# EAGLE design rc2014_3kb_ram (EAGLE 8.1.1)
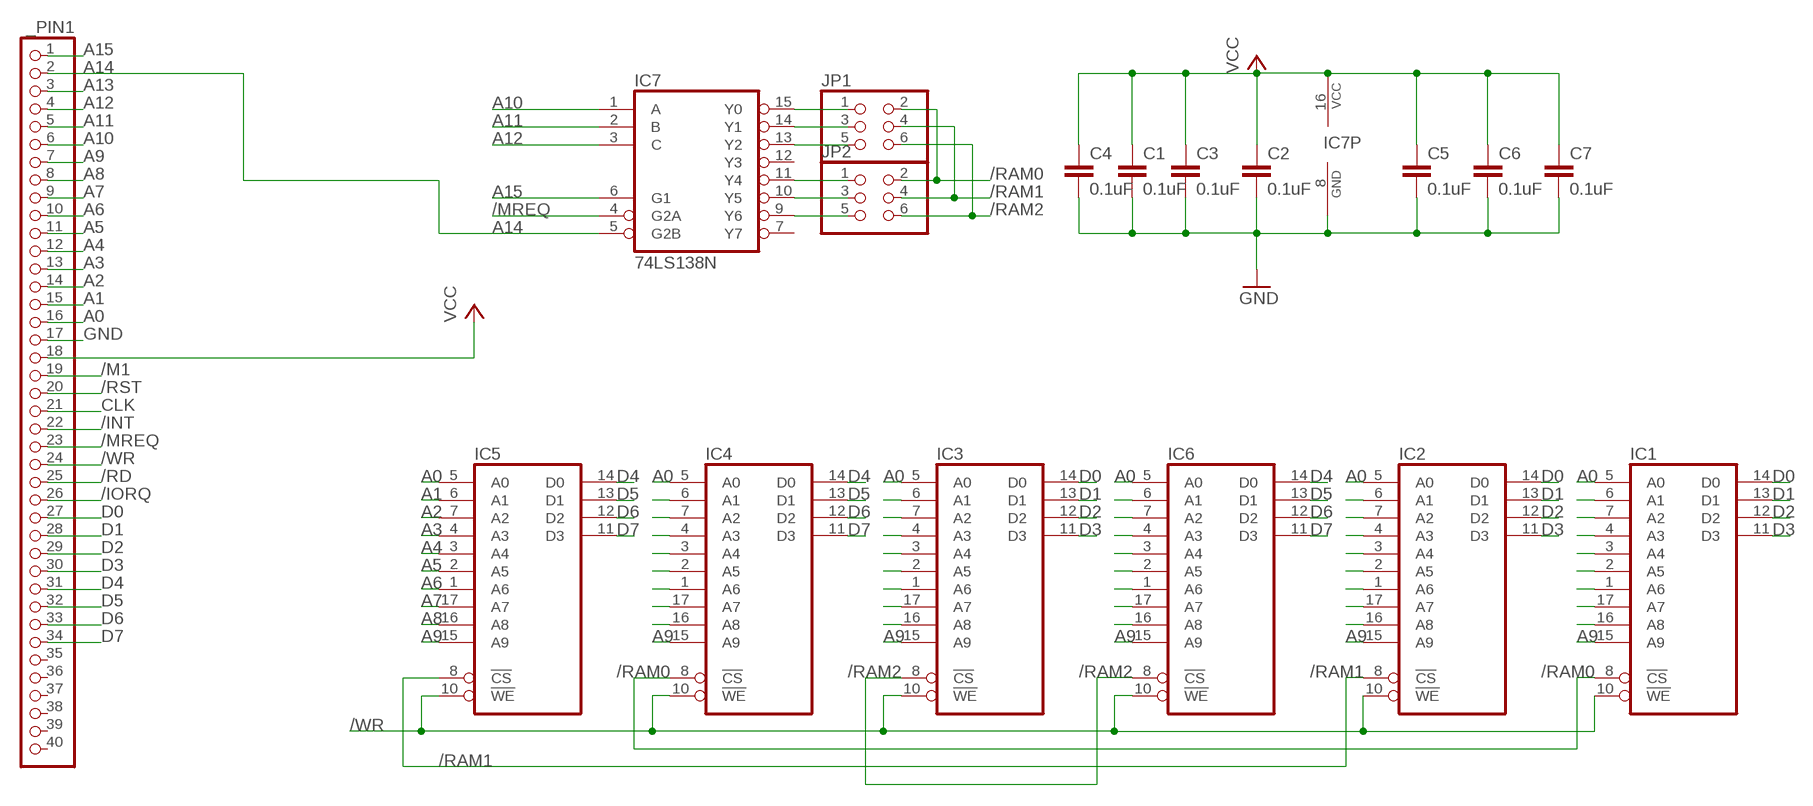
[diagram p0: schematic, sheet 1]

## Parts
_PIN1  PINHD-1X40  [1X40]
C1  0.1uF  C-EU050-024X044  [C050-024X044]
C2  0.1uF  C-EU050-024X044  [C050-024X044]
C3  0.1uF  C-EU050-024X044  [C050-024X044]
C4  0.1uF  C-EU050-024X044  [C050-024X044]
C5  0.1uF  C-EU050-024X044  [C050-024X044]
C6  0.1uF  C-EU050-024X044  [C050-024X044]
C7  0.1uF  C-EU050-024X044  [C050-024X044]
IC1  2114  [DIL18]
IC2  2114  [DIL18]
IC3  2114  [DIL18]
IC4  2114  [DIL18]
IC5  2114  [DIL18]
IC6  2114  [DIL18]
IC7  74LS138N  [DIL16]
JP1  PINHD-2X3  [2X03]
JP2  PINHD-2X3  [2X03]

## Nets
/INT: _PIN1.22
/IORQ: _PIN1.26
/M1: _PIN1.19
/MREQ: _PIN1.23 IC7.4(G2A)
/RAM0: IC1.8(!CS) IC4.8(!CS) JP1.2 JP2.2
/RAM1: IC2.8(!CS) IC5.8(!CS) JP1.4 JP2.4
/RAM2: IC3.8(!CS) IC6.8(!CS) JP1.6 JP2.6
/RD: _PIN1.25
/RST: _PIN1.20
/WR: _PIN1.24 IC1.10(!WE) IC2.10(!WE) IC3.10(!WE) IC4.10(!WE) IC5.10(!WE) IC6.10(!WE)
A0: _PIN1.16 IC1.5(A0) IC2.5(A0) IC3.5(A0) IC4.5(A0) IC5.5(A0) IC6.5(A0)
A1: _PIN1.15 IC1.6(A1) IC2.6(A1) IC3.6(A1) IC4.6(A1) IC5.6(A1) IC6.6(A1)
A2: _PIN1.14 IC1.7(A2) IC2.7(A2) IC3.7(A2) IC4.7(A2) IC5.7(A2) IC6.7(A2)
A3: _PIN1.13 IC1.4(A3) IC2.4(A3) IC3.4(A3) IC4.4(A3) IC5.4(A3) IC6.4(A3)
A4: _PIN1.12 IC1.3(A4) IC2.3(A4) IC3.3(A4) IC4.3(A4) IC5.3(A4) IC6.3(A4)
A5: _PIN1.11 IC1.2(A5) IC2.2(A5) IC3.2(A5) IC4.2(A5) IC5.2(A5) IC6.2(A5)
A6: _PIN1.10 IC1.1(A6) IC2.1(A6) IC3.1(A6) IC4.1(A6) IC5.1(A6) IC6.1(A6)
A7: _PIN1.9 IC1.17(A7) IC2.17(A7) IC3.17(A7) IC4.17(A7) IC5.17(A7) IC6.17(A7)
A8: _PIN1.8 IC1.16(A8) IC2.16(A8) IC3.16(A8) IC4.16(A8) IC5.16(A8) IC6.16(A8)
A9: _PIN1.7 IC1.15(A9) IC2.15(A9) IC3.15(A9) IC4.15(A9) IC5.15(A9) IC6.15(A9)
A10: _PIN1.6 IC7.1(A)
A11: _PIN1.5 IC7.2(B)
A12: _PIN1.4 IC7.3(C)
A13: _PIN1.3
A14: _PIN1.2 IC7.5(G2B)
A15: _PIN1.1 IC7.6(G1)
CLK: _PIN1.21
D0: _PIN1.27 IC1.14(D0) IC2.14(D0) IC3.14(D0)
D1: _PIN1.28 IC1.13(D1) IC2.13(D1) IC3.13(D1)
D2: _PIN1.29 IC1.12(D2) IC2.12(D2) IC3.12(D2)
D3: _PIN1.30 IC1.11(D3) IC2.11(D3) IC3.11(D3)
D4: _PIN1.31 IC4.14(D0) IC5.14(D0) IC6.14(D0)
D5: _PIN1.32 IC4.13(D1) IC5.13(D1) IC6.13(D1)
D6: _PIN1.33 IC4.12(D2) IC5.12(D2) IC6.12(D2)
D7: _PIN1.34 IC4.11(D3) IC5.11(D3) IC6.11(D3)
GND: _PIN1.17 C1.2 C2.2 C3.2 C4.2 C5.2 C6.2 C7.2 IC7.8(GND)
N$7: IC7.15(Y0) JP1.1
N$8: IC7.14(Y1) JP1.3
N$9: IC7.13(Y2) JP1.5
N$11: IC7.11(Y4) JP2.1
N$12: IC7.10(Y5) JP2.3
N$13: IC7.9(Y6) JP2.5
VCC: _PIN1.18 C1.1 C2.1 C3.1 C4.1 C5.1 C6.1 C7.1 IC7.16(VCC)
Unconnected: _PIN1.35 _PIN1.36 _PIN1.37 _PIN1.38 _PIN1.39 _PIN1.40 IC7.7(Y7) IC7.12(Y3)

## Power pins joined to a net without a drawn wire
GND: IC1.9(GND) IC2.9(GND) IC3.9(GND) IC4.9(GND) IC5.9(GND) IC6.9(GND)
VCC: IC1.18(VCC) IC2.18(VCC) IC3.18(VCC) IC4.18(VCC) IC5.18(VCC) IC6.18(VCC)

## Library data of the parts
_PIN1 = pinhead:PINHD-1X40: PIN HEADER
C1-C7 = rcl:C-EU: CAPACITOR, European symbol
IC1-IC6 = memory:2114: MEMORY
IC7 = 74xx-us:74*138: 3-line to 8-line DECODER/DEMULTIPLEXER
JP1 JP2 = pinhead:PINHD-2X3: PIN HEADER

## Net classes
0 +5V: width 0.508 mm

## Board
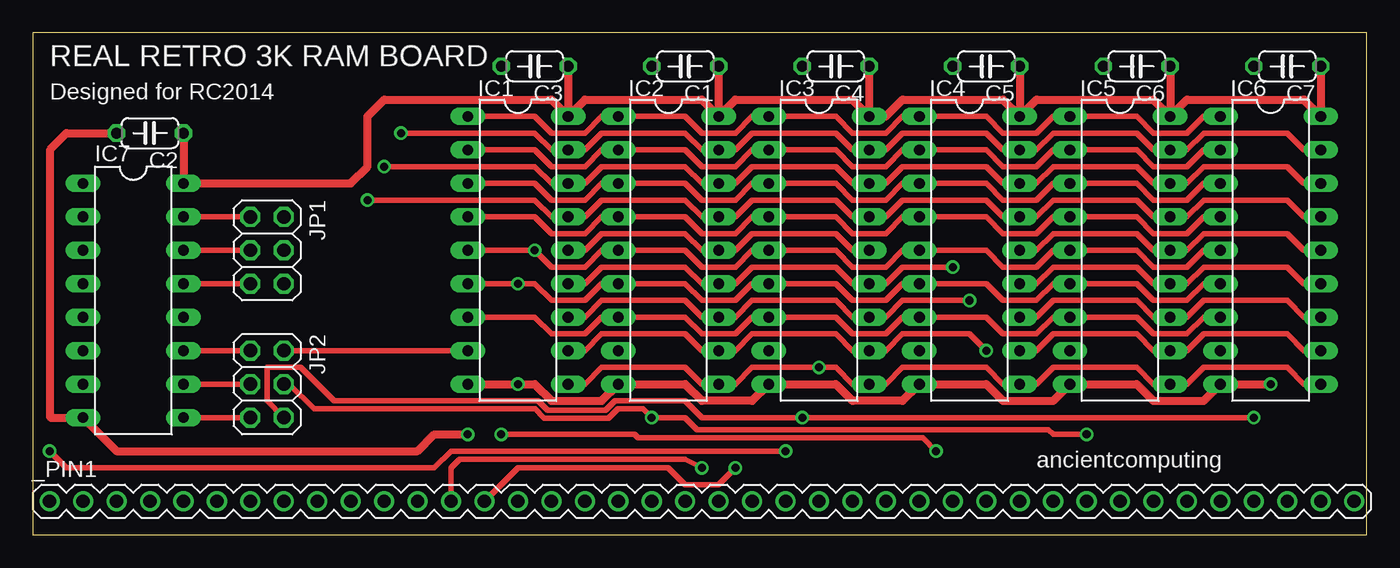
[diagram p1: board, top side]
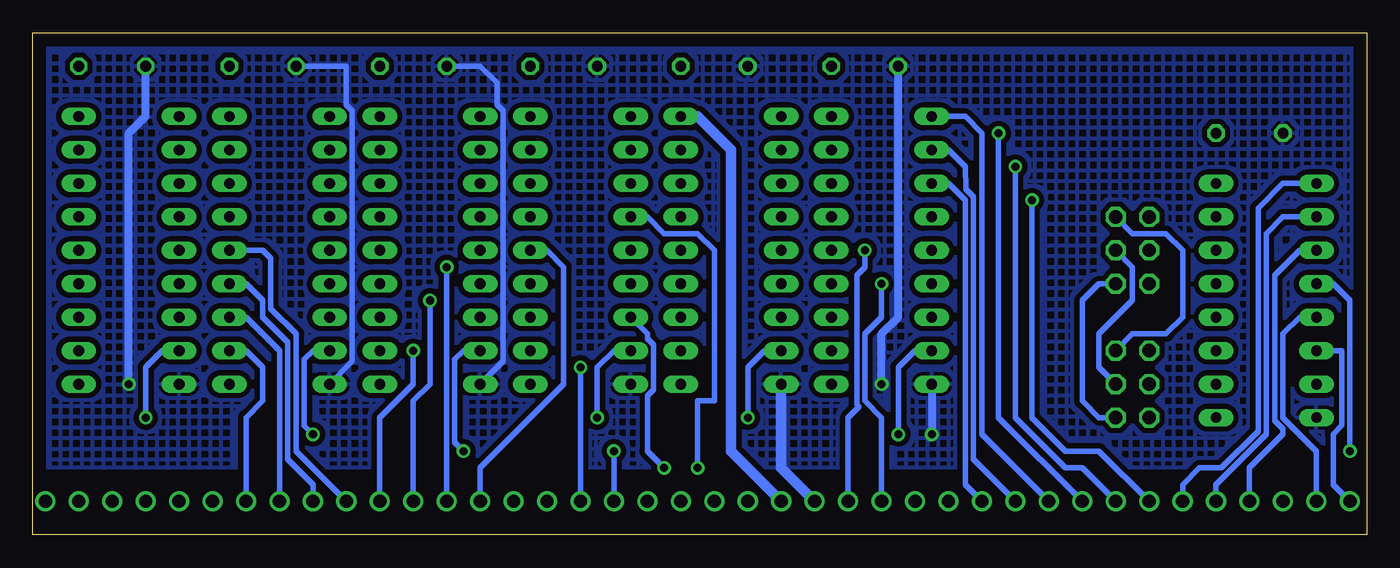
[diagram p2: board, bottom side, seen from below]

Size 101.27 x 38.09 mm. Coordinates in mm from the lower left corner, seen from the top.
Outline: 0,0 101.27,0 101.27,38.09 0,38.09 0,0
Copper layers (1*16): Top 0.035mm / dielectric 1.5mm / Bottom 0.035mm
Design rules "default *": minimum track width 20mil, minimum drill 24mil, track to track 8mil, track to pad 8mil, pad to pad 8mil, via to via 8mil, smd to smd 8mil, copper to edge 40mil, drill to drill 8mil, minimum pad ring 10mil, minimum via ring 8mil, stop-mask expansion 4mil, vias tented up to drill 0mil, thermal gap 10mil

### Footprints (pad centres in the part's own frame; a part is rotated, then mirrored left to right if it is on the bottom)
1X40 = drill 1.016: 1 -49.53,0; 2 -46.99,0; 3 -44.45,0; 4 -41.91,0; 5 -39.37,0; 6 -36.83,0; 7 -34.29,0; 8 -31.75,0; 9 -29.21,0; 10 -26.67,0; 11 -24.13,0; 12 -21.59,0; 13 -19.05,0; 14 -16.51,0; 15 -13.97,0; 16 -11.43,0; 17 -8.89,0; 18 -6.35,0; 19 -3.81,0; 20 -1.27,0; 21 1.27,0; 22 3.81,0; 23 6.35,0; 24 8.89,0; 25 11.43,0; 26 13.97,0; 27 16.51,0; 28 19.05,0; 29 21.59,0; 30 24.13,0; 31 26.67,0; 32 29.21,0; 33 31.75,0; 34 34.29,0; 35 36.83,0; 36 39.37,0; 37 41.91,0; 38 44.45,0; 39 46.99,0; 40 49.53,0
C050-024X044 = drill 0.813 octagon: 1 -2.54,0; 2 2.54,0
DIL18 = drill 0.813 long: 1 -10.16,-3.81; 2 -7.62,-3.81; 3 -5.08,-3.81; 4 -2.54,-3.81; 5 0,-3.81; 6 2.54,-3.81; 7 5.08,-3.81; 8 7.62,-3.81; 9 10.16,-3.81; 10 10.16,3.81; 11 7.62,3.81; 12 5.08,3.81; 13 2.54,3.81; 14 0,3.81; 15 -2.54,3.81; 16 -5.08,3.81; 17 -7.62,3.81; 18 -10.16,3.81
DIL16 = drill 0.813 long: 1 -8.89,-3.81; 2 -6.35,-3.81; 3 -3.81,-3.81; 4 -1.27,-3.81; 5 1.27,-3.81; 6 3.81,-3.81; 7 6.35,-3.81; 8 8.89,-3.81; 9 8.89,3.81; 10 6.35,3.81; 11 3.81,3.81; 12 1.27,3.81; 13 -1.27,3.81; 14 -3.81,3.81; 15 -6.35,3.81; 16 -8.89,3.81
2X03 = drill 1.016 octagon: 1 -2.54,-1.27; 2 -2.54,1.27; 3 0,-1.27; 4 0,1.27; 5 2.54,-1.27; 6 2.54,1.27

### Placement (x,y rotation side)
_PIN1  50.8,2.54 0 top
C1  49.53,35.56 180 top
C2  8.89,30.48 180 top
C3  38.1,35.56 180 top
C4  60.96,35.56 180 top
C5  72.39,35.56 180 top
C6  83.82,35.56 180 top
C7  95.25,35.56 180 top
IC1  36.83,21.59 270 top
IC2  48.26,21.59 270 top
IC3  59.69,21.59 270 top
IC4  71.12,21.59 270 top
IC5  82.55,21.59 270 top
IC6  93.98,21.59 270 top
IC7  7.62,17.78 270 top
JP1  17.78,21.59 270 top
JP2  17.78,11.43 270 top

### Tracks (layer width: path | path; a pad name or v marks a point on that pad's centre or on a via)
/MREQ  (via drill 0.61)
  Top 0.406: v1.27,6.35 2.54,5.08 30.48,5.08 31.75,6.35 v57.15,6.35
  Bottom 0.406: _PIN1.23 v57.15,6.35 | v1.27,6.35 1.27,17.78 2.54,19.05 IC7.4
/RAM0  (via drill 0.61)
  Top 0.406: v68.58,6.35 67.56,7.37 45.95,7.37 45.7,7.62 v35.56,7.62 | JP2.2 IC1.8
  Bottom 0.406: IC4.8 68.58,13.97 69.24,13.31 69.24,7.01 v68.58,6.35 | IC1.8 34.29,13.97 35.56,12.7 v35.56,7.62 | JP2.2 17.78,15.24 15.24,15.24 13.97,16.51 13.97,21.59 15.24,22.86 17.78,22.86 JP1.2
/RAM1  (via drill 0.61)
  Top 0.406: v80.01,7.62 77.47,7.62 77.11,7.98 50.42,7.98 49.51,8.89 v46.99,8.89 46.33,9.55 44.44,9.55 43.73,8.84 38.82,8.84 38.11,9.55 21.34,9.55 19.46,11.43 JP2.4
  Bottom 0.406: IC5.8 80.01,13.97 80.67,13.31 80.67,8.28 v80.01,7.62 | IC2.8 45.72,13.97 46.99,12.7 v46.99,8.89 | JP2.4 20.32,12.7 20.32,15.24 17.78,17.78 17.78,20.32 JP1.4
/RAM2  (via drill 0.61)
  Top 0.406: v92.71,8.89 v58.42,8.89 50.8,8.89 49.53,10.16 44.19,10.16 43.48,9.45 39.08,9.45 38.36,10.16 22.86,10.16 20.32,12.7 17.78,12.7 17.78,10.16 JP2.6
  Bottom 0.406: IC6.8 91.44,13.97 92.71,12.7 v92.71,8.89 | IC3.8 57.15,13.97 58.42,12.7 v58.42,8.89 | JP2.6 20.32,8.89 21.59,10.16 21.59,17.78 20.32,19.05 JP1.6
/WR  (via drill 0.61)
  Top 0.406: IC1.10 41.91,11.43 43.18,12.7 49.53,12.7 50.8,11.43 IC2.10 53.34,11.43 54.61,12.7 v59.69,12.7 60.96,12.7 62.23,11.43 IC3.10 64.77,11.43 66.04,12.7 72.39,12.7 73.66,11.43 IC4.10 76.2,11.43 77.47,12.7 83.82,12.7 85.09,11.43 IC5.10 87.63,11.43 88.9,12.7 95.25,12.7 96.52,11.43 IC6.10
  Bottom 0.406: _PIN1.24 v59.69,12.7
A0  (via drill 0.61)
  Top 0.406: IC1.5 v38.1,21.59 39.37,20.32 41.91,20.32 43.18,21.59 IC2.5 49.53,21.59 50.8,20.32 53.34,20.32 54.61,21.59 IC3.5 60.96,21.59 62.23,20.32 64.77,20.32 66.04,21.59 IC4.5 72.39,21.59 73.66,20.32 76.2,20.32 77.47,21.59 IC5.5 83.82,21.59 85.09,20.32 87.63,20.32 88.9,21.59 IC6.5
  Bottom 0.406: _PIN1.16 39.37,8.89 38.53,9.73 38.71,9.91 38.71,19.71 38.1,20.32 v38.1,21.59
A1  (via drill 0.61)
  Top 0.406: IC1.6 v36.83,19.05 38.1,19.05 39.37,17.78 41.91,17.78 43.18,19.05 IC2.6 49.53,19.05 50.8,17.78 53.34,17.78 54.61,19.05 IC3.6 60.96,19.05 62.23,17.78 64.77,17.78 66.04,19.05 IC4.6 72.39,19.05 73.66,17.78 76.2,17.78 77.47,19.05 IC5.6 83.82,19.05 85.09,17.78 87.63,17.78 88.9,19.05 IC6.6
  Bottom 0.406: _PIN1.15 36.83,8.89 38.1,10.16 38.1,15.24 36.83,16.51 v36.83,19.05
A2  (via drill 0.61)
  Top 0.406: IC1.7 38.1,16.51 39.37,15.24 41.91,15.24 43.18,16.51 IC2.7 49.53,16.51 50.8,15.24 53.34,15.24 54.61,16.51 IC3.7 57.15,16.51 60.96,16.51 62.23,15.24 64.77,15.24 66.04,16.51 IC4.7 72.39,16.51 73.66,15.24 76.2,15.24 77.47,16.51 IC5.7 83.82,16.51 85.09,15.24 87.63,15.24 88.9,16.51 IC6.7 | _PIN1.14 36.83,5.08 48.21,5.08 48.25,5.06 49.53,3.81 52.07,3.81 v53.34,5.08
  Bottom 0.406: IC3.7 54.61,15.24 54.61,14.87 54.15,14.41 54.15,10.99 54.61,10.53 54.61,6.35 v53.34,5.08
A3  (via drill 0.61)
  Top 0.406: IC1.4 38.1,24.13 39.37,22.86 41.91,22.86 43.18,24.13 IC2.4 49.53,24.13 50.8,22.86 53.34,22.86 54.61,24.13 IC3.4 60.96,24.13 62.23,22.86 64.77,22.86 66.04,24.13 IC4.4 72.39,24.13 73.66,22.86 76.2,22.86 77.47,24.13 IC5.4 83.82,24.13 85.09,22.86 87.63,22.86 88.9,24.13 IC6.4 | _PIN1.13 31.75,5.08 32.41,5.74 49.53,5.74 v50.8,5.08
  Bottom 0.406: v50.8,5.08 50.8,10.16 49.53,10.16 49.53,21.59 50.8,22.86 53.34,22.86 54.61,24.13 IC3.4
A4
  Top 0.406: IC1.3 38.1,26.67 39.37,25.4 41.91,25.4 43.18,26.67 IC2.3 49.53,26.67 50.8,25.4 53.34,25.4 54.61,26.67 IC3.3 60.96,26.67 62.23,25.4 64.77,25.4 66.04,26.67 IC4.3 72.39,26.67 73.66,25.4 76.2,25.4 77.47,26.67 IC5.3 83.82,26.67 85.09,25.4 87.63,25.4 88.9,26.67 IC6.3
  Bottom 0.406: _PIN1.12 30.48,3.81 30.48,25.4 31.75,26.67 IC1.3
A5
  Top 0.406: IC1.2 38.1,29.21 39.37,27.94 41.91,27.94 43.18,29.21 IC2.2 49.53,29.21 50.8,27.94 53.34,27.94 54.61,29.21 IC3.2 60.96,29.21 62.23,27.94 64.77,27.94 66.04,29.21 IC4.2 72.39,29.21 73.66,27.94 76.2,27.94 77.47,29.21 IC5.2 83.82,29.21 85.09,27.94 87.63,27.94 88.9,29.21 IC6.2
  Bottom 0.406: _PIN1.11 29.87,5.74 29.87,25.65 30.43,26.21 30.48,27.94 31.75,29.21 IC1.2
A6
  Top 0.406: IC1.1 38.1,31.75 39.37,30.48 41.91,30.48 43.18,31.75 IC2.1 49.53,31.75 50.8,30.48 53.34,30.48 54.61,31.75 IC3.1 60.96,31.75 62.23,30.48 64.77,30.48 66.04,31.75 IC4.1 72.39,31.75 73.66,30.48 76.2,30.48 77.47,31.75 IC5.1 83.82,31.75 85.09,30.48 87.63,30.48 88.9,31.75 IC6.1
  Bottom 0.406: _PIN1.10 29.21,7.62 29.21,30.48 30.48,31.75 IC1.1
A7  (via drill 0.61)
  Top 0.406: IC6.17 96.52,29.21 95.25,30.48 88.9,30.48 87.63,29.21 IC5.17 85.09,29.21 83.82,30.48 77.47,30.48 76.2,29.21 IC4.17 73.66,29.21 72.39,30.48 66.04,30.48 64.77,29.21 IC3.17 62.23,29.21 60.96,30.48 54.61,30.48 53.34,29.21 IC2.17 50.8,29.21 49.53,30.48 43.18,30.48 41.91,29.21 IC1.17 39.37,29.21 38.1,30.48 v27.94,30.48
  Bottom 0.406: _PIN1.9 27.94,8.89 v27.94,30.48
A8  (via drill 0.61)
  Top 0.406: IC6.16 96.52,26.67 95.25,27.94 88.9,27.94 87.63,26.67 IC5.16 85.09,26.67 83.82,27.94 77.47,27.94 76.2,26.67 IC4.16 73.66,26.67 72.39,27.94 66.04,27.94 64.77,26.67 IC3.16 62.23,26.67 60.96,27.94 54.61,27.94 53.34,26.67 IC2.16 50.8,26.67 49.53,27.94 43.18,27.94 41.91,26.67 IC1.16 39.37,26.67 38.1,27.94 v26.67,27.94
  Bottom 0.406: _PIN1.8 21.59,5.08 22.86,5.08 26.67,8.89 v26.67,27.94
A9  (via drill 0.61)
  Top 0.406: IC6.15 96.52,24.13 95.25,25.4 88.9,25.4 87.63,24.13 IC5.15 85.09,24.13 83.82,25.4 77.47,25.4 76.2,24.13 IC4.15 73.66,24.13 72.39,25.4 66.04,25.4 64.77,24.13 IC3.15 62.23,24.13 60.96,25.4 54.61,25.4 53.34,24.13 IC2.15 50.8,24.13 49.53,25.4 43.18,25.4 41.91,24.13 IC1.15 39.37,24.13 38.1,25.4 v25.4,25.4
  Bottom 0.406: v25.4,25.4 25.4,8.89 22.86,6.35 20.32,6.35 _PIN1.7
A10
  Bottom 0.406: _PIN1.6 13.97,3.81 12.7,5.08 11.02,5.08 8.23,7.87 8.23,24.79 6.35,26.67 IC7.1
A11
  Bottom 0.406: 11.43,3.81 _PIN1.5 11.43,3.81 | 11.43,3.81 7.62,7.62 7.62,22.86 6.35,24.13 IC7.2
A12
  Bottom 0.406: _PIN1.4 8.89,5.08 6.35,7.62 6.35,8.03 6.96,8.64 6.96,19.71 5.08,21.59 IC7.3
A14
  Bottom 0.406: _PIN1.2 3.81,6.35 6.35,8.89 6.35,15.24 5.08,16.51 IC7.5
A15
  Bottom 0.406: IC7.6 1.88,13.97 1.88,8.3 2.54,7.62 2.54,3.81 _PIN1.1
D0
  Top 0.406: IC1.14 41.91,21.59 43.18,22.86 49.53,22.86 50.8,21.59 IC2.14 53.34,21.59 54.61,22.86 60.96,22.86 62.23,21.59 IC3.14
  Bottom 0.406: _PIN1.27 67.31,5.08 60.96,11.43 60.96,20.32 62.23,21.59 IC3.14
D1  (via drill 0.61)
  Top 0.406: IC1.13 41.91,19.05 43.18,20.32 49.53,20.32 50.8,19.05 IC2.13 53.34,19.05 54.61,20.32 60.96,20.32 62.23,19.05 IC3.13 64.77,19.05 66.04,20.32 v69.85,20.32
  Bottom 0.406: _PIN1.28 v69.85,20.32
D2  (via drill 0.61)
  Top 0.406: IC1.12 41.91,16.51 43.18,17.78 49.53,17.78 50.8,16.51 IC2.12 53.34,16.51 54.61,17.78 60.96,17.78 62.23,16.51 IC3.12 64.77,16.51 66.04,17.78 v71.12,17.78
  Bottom 0.406: _PIN1.29 72.39,10.16 71.12,11.43 v71.12,17.78
D3  (via drill 0.61)
  Top 0.406: IC1.11 41.91,13.97 43.18,15.24 49.53,15.24 50.8,13.97 IC2.11 53.34,13.97 54.61,15.24 60.96,15.24 62.23,13.97 IC3.11 64.77,13.97 66.04,15.24 71.12,15.24 v72.39,13.97
  Bottom 0.406: _PIN1.30 74.93,8.89 72.39,11.43 v72.39,13.97
D4
  Top 0.406: IC4.14 76.2,21.59 77.47,22.86 83.82,22.86 85.09,21.59 IC5.14 87.63,21.59 88.9,22.86 95.25,22.86 96.52,21.59 IC6.14
  Bottom 0.406: _PIN1.31 81.28,6.35 81.28,15.24 83.21,17.17 83.21,20.98 83.82,21.59 IC5.14
D5
  Top 0.406: IC4.13 76.2,19.05 77.47,20.32 83.82,20.32 85.09,19.05 IC5.13 87.63,19.05 88.9,20.32 95.25,20.32 96.52,19.05 IC6.13
  Bottom 0.406: _PIN1.32 80.01,3.81 81.92,5.71 | 81.94,5.74 81.92,5.71 | 81.92,5.71 81.92,14.61 83.82,16.51 83.82,17.78 85.09,19.05 IC5.13
D6
  Top 0.406: IC4.12 76.2,16.51 77.47,17.78 83.82,17.78 85.09,16.51 IC5.12 87.63,16.51 88.9,17.78 95.25,17.78 96.52,16.51 IC6.12
  Bottom 0.406: _PIN1.33 82.55,13.97 85.09,16.51 IC5.12
D7
  Top 0.406: IC4.11 76.2,13.97 77.47,15.24 83.82,15.24 85.09,13.97 IC5.11 87.63,13.97 88.9,15.24 95.25,15.24 96.52,13.97 IC6.11
  Bottom 0.406: _PIN1.34 85.09,8.89 83.82,10.16 83.82,12.7 85.09,13.97 IC5.11
GND  (via drill 0.61)
  Top 0.61: IC1.9 v36.83,11.43 38.1,11.43 39.37,10.16 43.18,10.16 IC2.9 49.53,11.43 50.8,10.16 54.61,10.16 IC3.9 60.96,11.43 62.23,10.16 66.04,10.16 IC4.9 72.39,11.43 73.66,10.16 77.47,10.16 IC5.9 83.82,11.43 85.09,10.16 88.9,10.16 IC6.9 v93.98,11.43 | IC7.8 1.32,8.89 1.32,29.26 2.54,30.48 C2.2 | IC7.8 5.08,7.62 | IC7.8 6.35,6.35 29.21,6.35 30.48,7.62 v33.02,7.62
  Bottom 0.406: C6.2 77.47,35.56 77.47,32.65 77.01,32.19 77.01,13.16 IC5.9 | C5.2 67.31,35.56 66.04,34.29 66.04,32.65 65.58,32.19 65.58,13.16 IC4.9
  Bottom 0.61: IC1.9 v33.02,7.62 | v36.83,11.43 36.83,15.24 35.56,16.51 C3.2 | v93.98,11.43 93.98,30.48 92.71,31.75 C7.2
  Bottom 0.813: IC2.9 44.45,5.08 _PIN1.17
  pour Bottom (isolate 0.406, hatched): 0,38.1 0,5.08 101.6,5.08 101.6,38.1
N$7
  Top 0.406: IC7.15 JP1.1
N$8
  Top 0.406: IC7.14 JP1.3
N$9
  Top 0.406: IC7.13 JP1.5
N$11
  Top 0.406: IC7.11 JP2.1
N$12
  Top 0.406: IC7.10 JP2.3
N$13
  Top 0.406: IC7.9 JP2.5
VCC
  Top 0.61: IC5.18 87.63,33.02 96.52,33.02 IC6.18 C7.1 | IC4.18 76.2,33.02 85.09,33.02 IC5.18 | IC3.18 64.77,31.75 66.04,33.02 73.66,33.02 IC4.18 | IC2.18 53.34,33.02 62.23,33.02 IC3.18 | IC1.18 41.91,33.02 50.8,33.02 IC2.18 | C2.1 IC7.16 24.13,26.67 25.4,27.94 25.4,31.75 26.67,33.02 39.37,33.02 IC1.18 | C3.1 IC1.18 | C1.1 IC2.18 | C6.1 IC5.18 | C5.1 IC4.18 | C4.1 IC3.18
  Bottom 0.813: IC2.18 50.8,31.75 48.26,29.21 48.26,6.35 _PIN1.18

### Text on the board
tNames: REAL RETRO 3K RAM BOARD | Designed for RC2014 | ancientcomputing